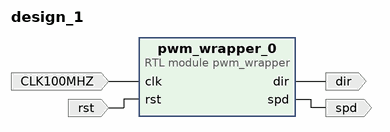
[diagram p0: block diagram of the top level]
# Vivado block design design_1, xc7s50csga324-1, Vivado 2023.2
create_bd_design design_1

create_bd_port -dir I -type clk CLK100MHZ
set_property -dict {CONFIG.FREQ_HZ 100000000} [get_bd_ports CLK100MHZ]
create_bd_port -dir I -type rst rst
set_property -dict {CONFIG.POLARITY ACTIVE_HIGH} [get_bd_ports rst]
create_bd_port -dir O spd
create_bd_port -dir O dir

create_bd_cell -type module -reference pwm_wrapper pwm_wrapper_0

# ---- connections ----

connect_bd_net [get_bd_ports CLK100MHZ] [get_bd_pins pwm_wrapper_0/clk]
connect_bd_net [get_bd_pins pwm_wrapper_0/dir] [get_bd_ports dir]
connect_bd_net [get_bd_pins pwm_wrapper_0/spd] [get_bd_ports spd]
connect_bd_net [get_bd_ports rst] [get_bd_pins pwm_wrapper_0/rst]

validate_bd_design
save_bd_design
